# Altium project Toy_Car.PrjPcb
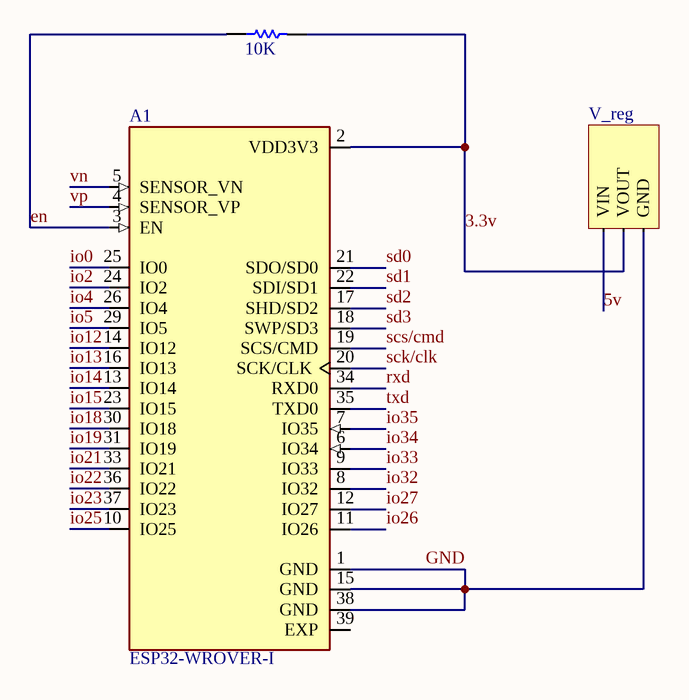
[diagram p0: Sheet1.SchDoc]
1 sheet, 3 parts. Net scope: global (net labels, ports and power ports of the same name join across sheets).
Board file: PCB1.PcbDoc

## Sheet Sheet1.SchDoc
size A4; SheetNumber: 1; SheetTotal: 1

### Parts
A1  ESP32-WROVER-I  [XCVR_ESP32-WROVER-I]
R1  value 10K  [AXIAL-0.3]  (hidden comment: Res1)
V_reg  AMS1117 Breakout Board  [AMS1117 Breakout Board]  (value not drawn)

### Nets
3.3v: A1.2(VDD3V3) R1.2 V_reg.VOUT
5v: V_reg.VIN
en: A1.3(EN) R1.1
GND: A1.1(GND) A1.15(GND) A1.38(GND) V_reg.GND
io0: A1.25(IO0)
io2: A1.24(IO2)
io4: A1.26(IO4)
io5: A1.29(IO5)
io12: A1.14(IO12)
io13: A1.16(IO13)
io14: A1.13(IO14)
io15: A1.23(IO15)
io18: A1.30(IO18)
io19: A1.31(IO19)
io21: A1.33(IO21)
io22: A1.36(IO22)
io23: A1.37(IO23)
io25: A1.10(IO25)
io26: A1.11(IO26)
io27: A1.12(IO27)
io32: A1.8(IO32)
io33: A1.9(IO33)
io34: A1.6(IO34)
io35: A1.7(IO35)
rxd: A1.34(RXD0)
sck/clk: A1.20(SCK/CLK)
scs/cmd: A1.19(SCS/CMD)
sd0: A1.21(SDO/SD0)
sd1: A1.22(SDI/SD1)
sd2: A1.17(SHD/SD2)
sd3: A1.18(SWP/SD3)
txd: A1.35(TXD0)
vn: A1.5(SENSOR_VN)
vp: A1.4(SENSOR_VP)

Not connected (* = marked no-connect by the designer): A1 39(EXP)

### Library data of the parts
A1 = ESP32-WROVER-I: Module: combo; GPIO, I2C x2, I2S x2, SDIO, SPI x3, UART x3; U.FL; Package: None; MP: ESP32-WROVER-I; Value: *; Availability: Unavailable; Price: None
R1 = Res1: Resistor; Published: 8-Jun-2000; LatestRevisionDate: 17-Jul-2002; LatestRevisionNote: Re-released for DXP Platform.; PackageReference: AXIAL-0.3; Publisher: Altium Limited; PackageDescription: Axial Device, Thru-Hole; 2 Leads; 0.3 in Pin Spacing